# EAGLE design hello (EAGLE 4.15)
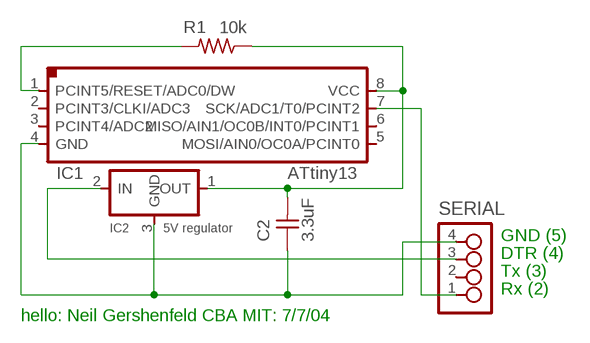
[diagram p0: schematic, sheet 1]

## Parts
C2  3.3uF  UNPOLARIZED_CAPACITOR1206  [1206]
IC1  ATTINY13SOIC8  [SOIC8]
IC2  5V regulator  REGULATORSOT23  [SOT23]
R1  10k  RESISTOR1206  [1206]
SERIAL  4_PIN_HEADERMICRO  [MICRO_4]

## Nets
N$1: C2.2 IC1.8(VCC) IC2.1(OUT) R1.1
N$2: C2.1 IC1.4(GND) IC2.3(GND) SERIAL.4
N$3: IC2.2(IN) SERIAL.3
N$4: IC1.7(SCK/ADC1/T0/PCINT2) SERIAL.1
N$6: IC1.1(PCINT5/RESET/ADC0/DW) R1.2
Unconnected: IC1.2(PCINT3/CLKI/ADC3) IC1.3(PCINT4/ADC2) IC1.5(MOSI/AIN0/OC0A/PCINT0) IC1.6(MISO/AIN1/OC0B/INT0/PCINT1) SERIAL.2

## Notes on the sheet
- GND (5)
- DTR (4)
- Tx (3)
- Rx (2)
- hello: Neil Gershenfeld CBA MIT: 7/7/04

## Library data of the parts
C2 = ng:UNPOLARIZED_CAPACITOR: unpolarized_capacitor
IC1 = ng:ATTINY13
IC2 = ng:REGULATOR
R1 = ng:RESISTOR
SERIAL = ng:4_PIN_HEADER: 4 SMT pin pads

## Board
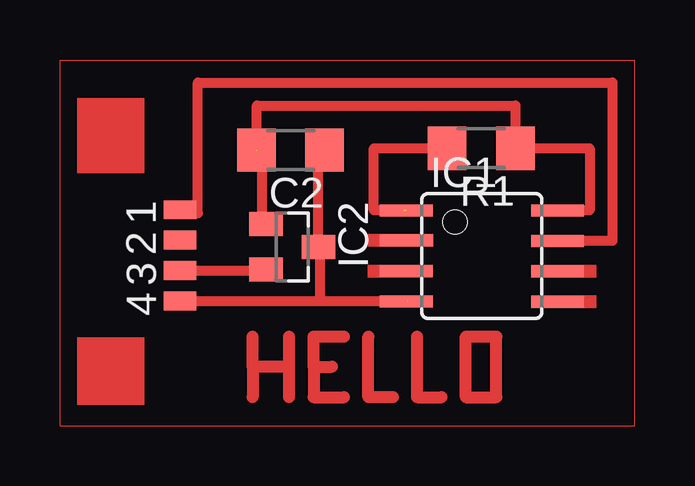
[diagram p1: board, top side]

No outline drawn. Coordinates in mm, seen from the top.
Copper layers (1*16): Top 0.035mm / dielectric 1.5mm / Bottom 0.035mm
Design rules "default": minimum track width 10mil, minimum drill 24mil, track to track 8mil, track to pad 8mil, pad to pad 8mil, via to via 8mil, smd to smd 8mil, copper to edge 40mil, drill to drill 8mil, minimum pad ring 10mil, minimum via ring 8mil, stop-mask expansion 4mil, vias tented up to drill 0mil, thermal gap 10mil

### Footprints (pad centres in the part's own frame; a part is rotated, then mirrored left to right if it is on the bottom)
1206 = smd 1.6 x 1.803: 1 -1.422,0; 2 1.422,0
SOIC8 = smd 0.5 x 2.2: 1 -1.905,-3.154; 2 -0.645,-3.154; 3 0.625,-3.154; 4 1.895,-3.154; 5 1.905,3.154; 6 0.635,3.154; 7 -0.635,3.154; 8 -1.905,3.154
SOT23 = smd 1 x 1.4: 1 -0.95,-1.1; 2 0.95,-1.1; 3 0,1.1
MICRO_4 = smd 0.787 x 1.346: 1 -1.905,1.626; 2 -0.635,1.626; 3 0.635,1.626; 4 1.905,1.626

### Placement (x,y rotation side)
C2  9.65,11.51 180 top
IC1  17.63,7.09 270 top
IC2  9.73,7.47 270 top
R1  17.6,11.58 180 top
SERIAL  3.43,7.11 270 top

### Tracks (layer width: path | path; a pad name or v marks a point on that pad's centre or on a via)
N$1  (1 unrouted)
  Top 0.406: C2.2 8.48,11.51 8.48,8.42 IC2.1 | 8.26,11.51 8.26,13.36 19.02,13.36 R1.1 22.12,11.58 22.12,8.99 IC1.8
N$2  (1 unrouted)
  Top 0.406: SERIAL.4 10.9,5.21 | 10.9,5.21 10.9,7.47 IC2.3 10.82,11.51 | 10.82,11.51 10.82,11.58 | 10.82,11.51 C2.1 | 14.53,5.18 14.53,5.19 IC1.4 | 10.9,5.21 14.53,5.21
N$3
  Top 0.406: IC2.2 8.66,6.52 8.66,6.48 SERIAL.3
N$4
  Top 0.406: SERIAL.1 5.79,8.87 5.79,14.33 23.06,14.33 23.06,7.72 20.62,7.72 IC1.7
N$5
  Top 0: 0.05,15.27 24,15.27 24,0 0.05,0 0.05,15.27
N$6  (1 unrouted)
  Top 0.406: R1.2 13.13,11.58 13.13,8.99 14.38,8.99
N$17
  Top 0.508: 8.08,2.46 8.08,1.19 | 8.08,2.46 8.08,3.73 | 9.6,2.46 8.08,2.46
N$19
  Top 0.508: 9.6,1.19 9.6,3.73
N$20
  Top 0.508: 10.62,2.46 10.62,3.73 11.89,3.73 | 10.62,2.46 10.62,1.19 11.89,1.19 | 10.62,2.46 11.38,2.46
N$21
  Top 0.508: 12.9,3.73 12.9,1.19 13.92,1.19
N$22
  Top 0.508: 14.94,3.73 14.94,1.19 15.95,1.19
N$23
  Top 0.508: 16.97,1.19 18.24,1.19 18.24,3.73 16.97,3.73 16.97,1.19
(copper drawn outside any net)
  shapes: Top area x6